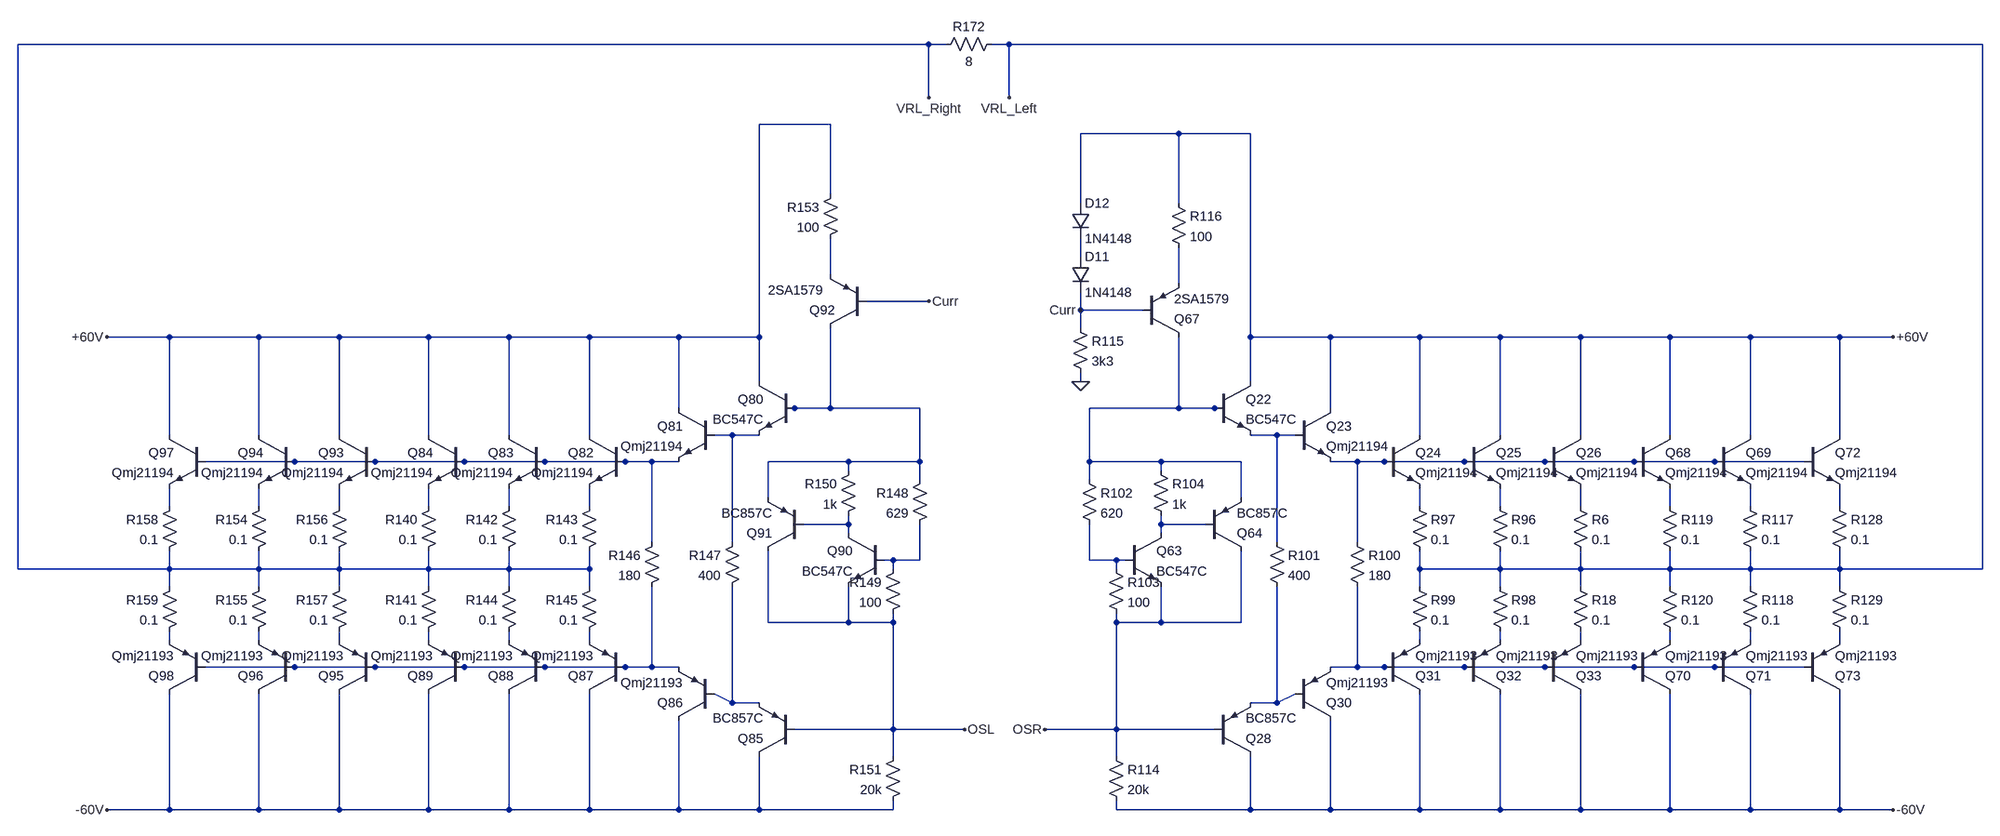
[diagram p0: schematic VOPTEX2.asc]
VOPTEX2.asc, the LTspice schematic file:
Version 4
SHEET 1 16980 7392
WIRE 7632 4496 6000 4496
WIRE 7664 4496 7632 4496
WIRE 7776 4496 7744 4496
WIRE 9520 4496 7776 4496
WIRE 7632 4592 7632 4496
WIRE 7776 4592 7776 4496
WIRE 7456 4640 7328 4640
WIRE 8080 4656 7904 4656
WIRE 8208 4656 8080 4656
WIRE 7456 4800 7456 4640
WIRE 7904 4816 7904 4656
WIRE 8080 4816 8080 4656
WIRE 7904 4912 7904 4880
WIRE 7456 4944 7456 4880
WIRE 8080 4960 8080 4896
WIRE 7632 4992 7520 4992
WIRE 7904 5008 7904 4976
WIRE 8016 5008 7904 5008
WIRE 7904 5040 7904 5008
WIRE 6272 5056 6160 5056
WIRE 6432 5056 6272 5056
WIRE 6576 5056 6432 5056
WIRE 6736 5056 6576 5056
WIRE 6880 5056 6736 5056
WIRE 7024 5056 6880 5056
WIRE 7184 5056 7024 5056
WIRE 7328 5056 7328 4640
WIRE 7328 5056 7184 5056
WIRE 8208 5056 8208 4656
WIRE 8352 5056 8208 5056
WIRE 8512 5056 8352 5056
WIRE 8656 5056 8512 5056
WIRE 8800 5056 8656 5056
WIRE 8960 5056 8800 5056
WIRE 9104 5056 8960 5056
WIRE 9264 5056 9104 5056
WIRE 9360 5056 9264 5056
WIRE 7328 5136 7328 5056
WIRE 7904 5136 7904 5120
WIRE 8208 5136 8208 5056
WIRE 7184 5184 7184 5056
WIRE 7392 5184 7376 5184
WIRE 7456 5184 7456 5040
WIRE 7456 5184 7392 5184
WIRE 7616 5184 7456 5184
WIRE 8080 5184 8080 5056
WIRE 8080 5184 7920 5184
WIRE 8144 5184 8080 5184
WIRE 8160 5184 8144 5184
WIRE 8352 5184 8352 5056
WIRE 6272 5232 6272 5056
WIRE 6432 5232 6432 5056
WIRE 6576 5232 6576 5056
WIRE 6736 5232 6736 5056
WIRE 6880 5232 6880 5056
WIRE 7024 5232 7024 5056
WIRE 7280 5232 7248 5232
WIRE 7328 5232 7280 5232
WIRE 8256 5232 8208 5232
WIRE 8288 5232 8256 5232
WIRE 8512 5232 8512 5056
WIRE 8656 5232 8656 5056
WIRE 8800 5232 8800 5056
WIRE 8960 5232 8960 5056
WIRE 9104 5232 9104 5056
WIRE 9264 5232 9264 5056
WIRE 6496 5280 6336 5280
WIRE 6640 5280 6496 5280
WIRE 6800 5280 6640 5280
WIRE 6944 5280 6800 5280
WIRE 7088 5280 6944 5280
WIRE 7136 5280 7088 5280
WIRE 7184 5280 7136 5280
WIRE 7488 5280 7344 5280
WIRE 7616 5280 7616 5184
WIRE 7616 5280 7488 5280
WIRE 7920 5280 7920 5184
WIRE 8048 5280 7920 5280
WIRE 8192 5280 8048 5280
WIRE 8400 5280 8352 5280
WIRE 8448 5280 8400 5280
WIRE 8592 5280 8448 5280
WIRE 8736 5280 8592 5280
WIRE 8896 5280 8736 5280
WIRE 9040 5280 8896 5280
WIRE 9200 5280 9040 5280
WIRE 7488 5296 7488 5280
WIRE 8048 5296 8048 5280
WIRE 7616 5312 7616 5280
WIRE 7920 5312 7920 5280
WIRE 7344 5344 7344 5280
WIRE 8192 5344 8192 5280
WIRE 6272 5360 6272 5328
WIRE 6432 5360 6432 5328
WIRE 6576 5360 6576 5328
WIRE 6736 5360 6736 5328
WIRE 6880 5360 6880 5328
WIRE 7024 5360 7024 5328
WIRE 8512 5360 8512 5328
WIRE 8656 5360 8656 5328
WIRE 8800 5360 8800 5328
WIRE 8960 5360 8960 5328
WIRE 9104 5360 9104 5328
WIRE 9264 5360 9264 5328
WIRE 7488 5392 7488 5376
WIRE 7488 5392 7408 5392
WIRE 8048 5392 8048 5376
WIRE 8128 5392 8048 5392
WIRE 7488 5408 7488 5392
WIRE 8048 5408 8048 5392
WIRE 7136 5424 7136 5280
WIRE 7280 5424 7280 5232
WIRE 8256 5424 8256 5232
WIRE 8400 5424 8400 5280
WIRE 7568 5456 7552 5456
WIRE 7616 5456 7616 5392
WIRE 7616 5456 7568 5456
WIRE 7920 5456 7920 5392
WIRE 7968 5456 7920 5456
WIRE 7984 5456 7968 5456
WIRE 6000 5472 6000 4496
WIRE 6272 5472 6272 5440
WIRE 6272 5472 6000 5472
WIRE 6432 5472 6432 5440
WIRE 6432 5472 6272 5472
WIRE 6576 5472 6576 5440
WIRE 6576 5472 6432 5472
WIRE 6736 5472 6736 5440
WIRE 6736 5472 6576 5472
WIRE 6880 5472 6880 5440
WIRE 6880 5472 6736 5472
WIRE 7024 5472 7024 5440
WIRE 7024 5472 6880 5472
WIRE 7568 5472 7568 5456
WIRE 7968 5472 7968 5456
WIRE 8512 5472 8512 5440
WIRE 8656 5472 8656 5440
WIRE 8656 5472 8512 5472
WIRE 8800 5472 8800 5440
WIRE 8800 5472 8656 5472
WIRE 8960 5472 8960 5440
WIRE 8960 5472 8800 5472
WIRE 9104 5472 9104 5440
WIRE 9104 5472 8960 5472
WIRE 9264 5472 9264 5440
WIRE 9264 5472 9104 5472
WIRE 9520 5472 9520 4496
WIRE 9520 5472 9264 5472
WIRE 6272 5504 6272 5472
WIRE 6432 5504 6432 5472
WIRE 6576 5504 6576 5472
WIRE 6736 5504 6736 5472
WIRE 6880 5504 6880 5472
WIRE 7024 5504 7024 5472
WIRE 8512 5504 8512 5472
WIRE 8656 5504 8656 5472
WIRE 8800 5504 8800 5472
WIRE 8960 5504 8960 5472
WIRE 9104 5504 9104 5472
WIRE 9264 5504 9264 5472
WIRE 7344 5568 7344 5440
WIRE 7488 5568 7488 5504
WIRE 7488 5568 7344 5568
WIRE 7568 5568 7568 5552
WIRE 7568 5568 7488 5568
WIRE 7968 5568 7968 5552
WIRE 8048 5568 8048 5504
WIRE 8048 5568 7968 5568
WIRE 8192 5568 8192 5440
WIRE 8192 5568 8048 5568
WIRE 6272 5600 6272 5584
WIRE 6432 5600 6432 5584
WIRE 6576 5600 6576 5584
WIRE 6736 5600 6736 5584
WIRE 6880 5600 6880 5584
WIRE 7024 5600 7024 5584
WIRE 8512 5600 8512 5584
WIRE 8656 5600 8656 5584
WIRE 8800 5600 8800 5584
WIRE 8960 5600 8960 5584
WIRE 9104 5600 9104 5584
WIRE 9264 5600 9264 5584
WIRE 6496 5648 6336 5648
WIRE 6640 5648 6496 5648
WIRE 6800 5648 6640 5648
WIRE 6944 5648 6800 5648
WIRE 7088 5648 6944 5648
WIRE 7136 5648 7136 5504
WIRE 7136 5648 7088 5648
WIRE 7184 5648 7136 5648
WIRE 8400 5648 8400 5504
WIRE 8400 5648 8352 5648
WIRE 8448 5648 8400 5648
WIRE 8592 5648 8448 5648
WIRE 8736 5648 8592 5648
WIRE 8896 5648 8736 5648
WIRE 9040 5648 8896 5648
WIRE 9200 5648 9040 5648
WIRE 7280 5712 7280 5504
WIRE 7280 5712 7248 5696
WIRE 7328 5712 7280 5712
WIRE 8256 5712 8256 5504
WIRE 8256 5712 8288 5696
WIRE 8256 5712 8208 5712
WIRE 7568 5760 7568 5568
WIRE 7568 5760 7392 5760
WIRE 7696 5760 7568 5760
WIRE 7968 5760 7968 5568
WIRE 7968 5760 7840 5760
WIRE 8144 5760 7968 5760
WIRE 7568 5808 7568 5760
WIRE 7968 5808 7968 5760
WIRE 6272 5904 6272 5696
WIRE 6272 5904 6160 5904
WIRE 6432 5904 6432 5696
WIRE 6432 5904 6272 5904
WIRE 6576 5904 6576 5696
WIRE 6576 5904 6432 5904
WIRE 6736 5904 6736 5696
WIRE 6736 5904 6576 5904
WIRE 6880 5904 6880 5696
WIRE 6880 5904 6736 5904
WIRE 7024 5904 7024 5696
WIRE 7024 5904 6880 5904
WIRE 7184 5904 7184 5744
WIRE 7184 5904 7024 5904
WIRE 7328 5904 7328 5808
WIRE 7328 5904 7184 5904
WIRE 7568 5904 7568 5888
WIRE 7568 5904 7328 5904
WIRE 7968 5904 7968 5888
WIRE 8208 5904 8208 5808
WIRE 8208 5904 7968 5904
WIRE 8352 5904 8352 5744
WIRE 8352 5904 8208 5904
WIRE 8512 5904 8512 5696
WIRE 8512 5904 8352 5904
WIRE 8656 5904 8656 5696
WIRE 8656 5904 8512 5904
WIRE 8800 5904 8800 5696
WIRE 8800 5904 8656 5904
WIRE 8960 5904 8960 5696
WIRE 8960 5904 8800 5904
WIRE 9104 5904 9104 5696
WIRE 9104 5904 8960 5904
WIRE 9264 5904 9264 5696
WIRE 9264 5904 9104 5904
WIRE 9360 5904 9264 5904
FLAG 7904 5136 0
FLAG 9360 5904 -60V
FLAG 9360 5056 +60V
FLAG 6160 5904 -60V
FLAG 6160 5056 +60V
FLAG 7904 5008 Curr
FLAG 7632 4992 Curr
FLAG 7696 5760 OSL
FLAG 7840 5760 OSR
FLAG 7632 4592 VRL_Right
FLAG 7776 4592 VRL_Left
SYMBOL npn 8144 5136 R0
SYMATTR InstName Q22
SYMATTR Value BC547C
SYMBOL npn 8288 5184 R0
SYMATTR InstName Q23
SYMATTR Value Qmj21194
SYMBOL npn 8448 5232 R0
SYMATTR InstName Q24
SYMATTR Value Qmj21194
SYMBOL npn 8592 5232 R0
SYMATTR InstName Q25
SYMATTR Value Qmj21194
SYMBOL npn 8736 5232 R0
SYMATTR InstName Q26
SYMATTR Value Qmj21194
SYMBOL pnp 8144 5808 M180
SYMATTR InstName Q28
SYMATTR Value BC857C
SYMBOL pnp 8288 5744 M180
SYMATTR InstName Q30
SYMATTR Value Qmj21193
SYMBOL pnp 8448 5696 M180
SYMATTR InstName Q31
SYMATTR Value Qmj21193
SYMBOL pnp 8592 5696 M180
SYMATTR InstName Q32
SYMATTR Value Qmj21193
SYMBOL pnp 8736 5696 M180
SYMATTR InstName Q33
SYMATTR Value Qmj21193
SYMBOL res 8784 5344 R0
SYMATTR InstName R6
SYMATTR Value 0.1
SYMBOL res 8784 5488 R0
SYMATTR InstName R18
SYMATTR Value 0.1
SYMBOL res 8640 5344 R0
SYMATTR InstName R96
SYMATTR Value 0.1
SYMBOL res 8496 5344 R0
SYMATTR InstName R97
SYMATTR Value 0.1
SYMBOL res 8640 5488 R0
SYMATTR InstName R98
SYMATTR Value 0.1
SYMBOL res 8496 5488 R0
SYMATTR InstName R99
SYMATTR Value 0.1
SYMBOL res 8384 5408 R0
SYMATTR InstName R100
SYMATTR Value 180
SYMBOL res 8240 5408 R0
SYMATTR InstName R101
SYMATTR Value 400
SYMBOL npn 7984 5408 R0
SYMATTR InstName Q63
SYMATTR Value BC547C
SYMBOL res 7904 5296 R0
SYMATTR InstName R102
SYMATTR Value 620
SYMBOL res 7952 5456 R0
SYMATTR InstName R103
SYMATTR Value 100
SYMBOL res 8032 5280 R0
SYMATTR InstName R104
SYMATTR Value 1k
SYMBOL pnp 8128 5440 M180
SYMATTR InstName Q64
SYMATTR Value BC857C
SYMBOL res 7952 5792 R0
SYMATTR InstName R114
SYMATTR Value 20k
SYMBOL pnp 8016 5056 M180
SYMATTR InstName Q67
SYMATTR Value 2SA1579
SYMBOL res 7888 5024 R0
SYMATTR InstName R115
SYMATTR Value 3k3
SYMBOL diode 7888 4912 R0
SYMATTR InstName D11
SYMATTR Value 1N4148
SYMBOL diode 7888 4816 R0
SYMATTR InstName D12
SYMATTR Value 1N4148
SYMBOL res 8064 4800 R0
SYMATTR InstName R116
SYMATTR Value 100
SYMBOL npn 8896 5232 R0
SYMATTR InstName Q68
SYMATTR Value Qmj21194
SYMBOL npn 9040 5232 R0
SYMATTR InstName Q69
SYMATTR Value Qmj21194
SYMBOL pnp 8896 5696 M180
SYMATTR InstName Q70
SYMATTR Value Qmj21193
SYMBOL pnp 9040 5696 M180
SYMATTR InstName Q71
SYMATTR Value Qmj21193
SYMBOL res 9088 5344 R0
SYMATTR InstName R117
SYMATTR Value 0.1
SYMBOL res 9088 5488 R0
SYMATTR InstName R118
SYMATTR Value 0.1
SYMBOL res 8944 5344 R0
SYMATTR InstName R119
SYMATTR Value 0.1
SYMBOL res 8944 5488 R0
SYMATTR InstName R120
SYMATTR Value 0.1
SYMBOL npn 9200 5232 R0
SYMATTR InstName Q72
SYMATTR Value Qmj21194
SYMBOL pnp 9200 5696 M180
SYMATTR InstName Q73
SYMATTR Value Qmj21193
SYMBOL res 9248 5344 R0
SYMATTR InstName R128
SYMATTR Value 0.1
SYMBOL res 9248 5488 R0
SYMATTR InstName R129
SYMATTR Value 0.1
SYMBOL npn 7392 5136 M0
SYMATTR InstName Q80
SYMATTR Value BC547C
SYMBOL npn 7248 5184 M0
SYMATTR InstName Q81
SYMATTR Value Qmj21194
SYMBOL npn 7088 5232 M0
SYMATTR InstName Q82
SYMATTR Value Qmj21194
SYMBOL npn 6944 5232 M0
SYMATTR InstName Q83
SYMATTR Value Qmj21194
SYMBOL npn 6800 5232 M0
SYMATTR InstName Q84
SYMATTR Value Qmj21194
SYMBOL pnp 7392 5808 R180
SYMATTR InstName Q85
SYMATTR Value BC857C
SYMBOL pnp 7248 5744 R180
SYMATTR InstName Q86
SYMATTR Value Qmj21193
SYMBOL pnp 7088 5696 R180
SYMATTR InstName Q87
SYMATTR Value Qmj21193
SYMBOL pnp 6944 5696 R180
SYMATTR InstName Q88
SYMATTR Value Qmj21193
SYMBOL pnp 6800 5696 R180
SYMATTR InstName Q89
SYMATTR Value Qmj21193
SYMBOL res 6752 5344 M0
SYMATTR InstName R140
SYMATTR Value 0.1
SYMBOL res 6752 5488 M0
SYMATTR InstName R141
SYMATTR Value 0.1
SYMBOL res 6896 5344 M0
SYMATTR InstName R142
SYMATTR Value 0.1
SYMBOL res 7040 5344 M0
SYMATTR InstName R143
SYMATTR Value 0.1
SYMBOL res 6896 5488 M0
SYMATTR InstName R144
SYMATTR Value 0.1
SYMBOL res 7040 5488 M0
SYMATTR InstName R145
SYMATTR Value 0.1
SYMBOL res 7152 5408 M0
SYMATTR InstName R146
SYMATTR Value 180
SYMBOL res 7296 5408 M0
SYMATTR InstName R147
SYMATTR Value 400
SYMBOL npn 7552 5408 M0
SYMATTR InstName Q90
SYMATTR Value BC547C
SYMBOL res 7632 5296 M0
SYMATTR InstName R148
SYMATTR Value 629
SYMBOL res 7584 5456 M0
SYMATTR InstName R149
SYMATTR Value 100
SYMBOL res 7504 5280 M0
SYMATTR InstName R150
SYMATTR Value 1k
SYMBOL pnp 7408 5440 R180
SYMATTR InstName Q91
SYMATTR Value BC857C
SYMBOL res 7584 5792 M0
SYMATTR InstName R151
SYMATTR Value 20k
SYMBOL pnp 7520 5040 R180
WINDOW 3 77 68 Left 2
SYMATTR Value 2SA1579
SYMATTR InstName Q92
SYMBOL res 7472 4784 M0
SYMATTR InstName R153
SYMATTR Value 100
SYMBOL npn 6640 5232 M0
SYMATTR InstName Q93
SYMATTR Value Qmj21194
SYMBOL npn 6496 5232 M0
SYMATTR InstName Q94
SYMATTR Value Qmj21194
SYMBOL pnp 6640 5696 R180
SYMATTR InstName Q95
SYMATTR Value Qmj21193
SYMBOL pnp 6496 5696 R180
SYMATTR InstName Q96
SYMATTR Value Qmj21193
SYMBOL res 6448 5344 M0
SYMATTR InstName R154
SYMATTR Value 0.1
SYMBOL res 6448 5488 M0
SYMATTR InstName R155
SYMATTR Value 0.1
SYMBOL res 6592 5344 M0
SYMATTR InstName R156
SYMATTR Value 0.1
SYMBOL res 6592 5488 M0
SYMATTR InstName R157
SYMATTR Value 0.1
SYMBOL npn 6336 5232 M0
SYMATTR InstName Q97
SYMATTR Value Qmj21194
SYMBOL pnp 6336 5696 R180
SYMATTR InstName Q98
SYMATTR Value Qmj21193
SYMBOL res 6288 5344 M0
SYMATTR InstName R158
SYMATTR Value 0.1
SYMBOL res 6288 5488 M0
SYMATTR InstName R159
SYMATTR Value 0.1
SYMBOL res 7760 4480 R90
WINDOW 0 0 56 VBottom 2
WINDOW 3 32 56 VTop 2
SYMATTR InstName R172
SYMATTR Value 8

The netlist it stands for:
* VOPTEX2.asc
Q22 +60V N005 N007 0 BC547C
Q23 +60V N007 N009 0 Qmj21194
Q24 +60V N009 N016 0 Qmj21194
Q25 +60V N009 N017 0 Qmj21194
Q26 +60V N009 N018 0 Qmj21194
Q28 -60V OSR N041 0 BC857C
Q30 -60V N041 N039 0 Qmj21193
Q31 -60V N039 N032 0 Qmj21193
Q32 -60V N039 N033 0 Qmj21193
Q33 -60V N039 N034 0 Qmj21193
R6 N018 VRL_Left 0.1
R18 VRL_Left N034 0.1
R96 N017 VRL_Left 0.1
R97 N016 VRL_Left 0.1
R98 VRL_Left N033 0.1
R99 VRL_Left N032 0.1
R100 N009 N039 180
R101 N007 N041 400
Q63 N023 N025 OSR 0 BC547C
R102 N005 N025 620
R103 N025 OSR 100
R104 N005 N023 1k
Q64 OSR N023 N005 0 BC857C
R114 OSR -60V 20k
Q67 N005 Curr N003 0 2SA1579
R115 Curr 0 3k3
D11 N001 Curr 1N4148
D12 +60V N001 1N4148
R116 +60V N003 100
Q68 +60V N009 N019 0 Qmj21194
Q69 +60V N009 N020 0 Qmj21194
Q70 -60V N039 N035 0 Qmj21193
Q71 -60V N039 N036 0 Qmj21193
R117 N020 VRL_Left 0.1
R118 VRL_Left N036 0.1
R119 N019 VRL_Left 0.1
R120 VRL_Left N035 0.1
Q72 +60V N009 N021 0 Qmj21194
Q73 -60V N039 N037 0 Qmj21193
R128 N021 VRL_Left 0.1
R129 VRL_Left N037 0.1
Q80 +60V N004 N006 0 BC547C
Q81 +60V N006 N008 0 Qmj21194
Q82 +60V N008 N015 0 Qmj21194
Q83 +60V N008 N014 0 Qmj21194
Q84 +60V N008 N013 0 Qmj21194
Q85 -60V OSL N040 0 BC857C
Q86 -60V N040 N038 0 Qmj21193
Q87 -60V N038 N031 0 Qmj21193
Q88 -60V N038 N030 0 Qmj21193
Q89 -60V N038 N029 0 Qmj21193
R140 N013 VRL_Right 0.1
R141 VRL_Right N029 0.1
R142 N014 VRL_Right 0.1
R143 N015 VRL_Right 0.1
R144 VRL_Right N030 0.1
R145 VRL_Right N031 0.1
R146 N008 N038 180
R147 N006 N040 400
Q90 N022 N024 OSL 0 BC547C
R148 N004 N024 629
R149 N024 OSL 100
R150 N004 N022 1k
Q91 OSL N022 N004 0 BC857C
R151 OSL -60V 20k
Q92 N004 Curr N002 0 2SA1579
R153 +60V N002 100
Q93 +60V N008 N012 0 Qmj21194
Q94 +60V N008 N011 0 Qmj21194
Q95 -60V N038 N028 0 Qmj21193
Q96 -60V N038 N027 0 Qmj21193
R154 N011 VRL_Right 0.1
R155 VRL_Right N027 0.1
R156 N012 VRL_Right 0.1
R157 VRL_Right N028 0.1
Q97 +60V N008 N010 0 Qmj21194
Q98 -60V N038 N026 0 Qmj21193
R158 N010 VRL_Right 0.1
R159 VRL_Right N026 0.1
R172 VRL_Left VRL_Right 8
.model D D
.lib standard.dio
.model NPN NPN
.model PNP PNP
.lib standard.bjt
.backanno
.end